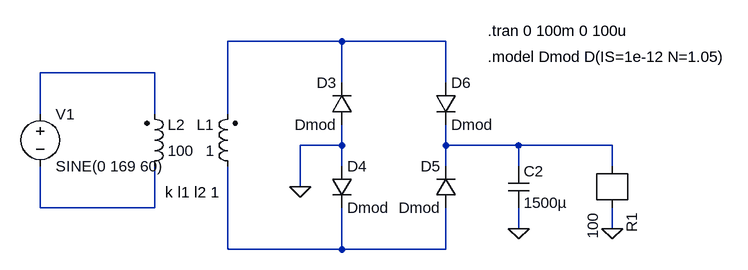
[diagram p0: schematic circuit_a_lt.asc]
circuit_a_lt.asc, the LTspice schematic file:
Version 4
SHEET 1 2116 1016
WIRE 496 -256 320 -256
WIRE 656 -256 496 -256
WIRE 208 -208 32 -208
WIRE 496 -192 496 -256
WIRE 656 -192 656 -256
WIRE 32 -144 32 -208
WIRE 208 -144 208 -208
WIRE 320 -144 320 -256
WIRE 496 -96 496 -128
WIRE 496 -96 432 -96
WIRE 656 -96 656 -128
WIRE 768 -96 656 -96
WIRE 912 -96 768 -96
WIRE 496 -64 496 -96
WIRE 656 -64 656 -96
WIRE 768 -64 768 -96
WIRE 912 -64 912 -96
WIRE 432 -32 432 -96
WIRE 32 0 32 -64
WIRE 208 0 208 -64
WIRE 208 0 32 0
WIRE 768 32 768 0
WIRE 912 32 912 0
WIRE 320 64 320 -64
WIRE 496 64 496 0
WIRE 496 64 320 64
WIRE 656 64 656 0
WIRE 656 64 496 64
FLAG 768 32 0
FLAG 912 32 0
FLAG 432 -32 0
SYMBOL voltage 32 -160 R0
SYMATTR InstName V1
SYMATTR Value SINE(0 169 60)
SYMATTR SpiceLine Rser=1
SYMBOL cap 752 -64 R0
SYMATTR InstName C2
SYMATTR Value 1500µ
SYMBOL ind2 336 -48 R180
WINDOW 0 36 80 Left 2
WINDOW 3 36 40 Left 2
SYMATTR InstName L1
SYMATTR Value 1
SYMATTR Type ind
SYMBOL ind2 192 -48 M180
WINDOW 0 36 80 Left 2
WINDOW 3 36 40 Left 2
SYMATTR InstName L2
SYMATTR Value 100
SYMATTR Type ind
SYMBOL r 912 -64 R90
SYMATTR InstName R1
SYMATTR Value 100
SYMBOL diode 512 -128 R180
WINDOW 0 24 64 Left 2
WINDOW 3 24 0 Left 2
SYMATTR InstName D3
SYMATTR Value Dmod
SYMBOL diode 480 -64 R0
SYMATTR InstName D4
SYMATTR Value Dmod
SYMBOL diode 672 0 R180
WINDOW 0 24 64 Left 2
WINDOW 3 24 0 Left 2
SYMATTR InstName D5
SYMATTR Value Dmod
SYMBOL diode 640 -192 R0
SYMATTR InstName D6
SYMATTR Value Dmod
TEXT 720 -272 Left 2 !.tran 0 100m 0 100u
TEXT 720 -232 Left 2 !.model Dmod D(IS=1e-12 N=1.05)
TEXT 224 -24 Left 2 !k l1 l2 1

The netlist it stands for:
* circuit_a_lt.asc
V1 N002 N004 SINE(0 169 60) Rser=1
C2 N003 0 1500µ
L1 N005 N001 1
L2 N004 N002 100
R1 0 N003 100
D3 0 N001 Dmod
D4 0 N005 Dmod
D5 N005 N003 Dmod
D6 N001 N003 Dmod
.model D D
.lib standard.dio
.tran 0 100m 0 100u
.model Dmod D(IS=1e-12 N=1.05)
k l1 l2 1
.backanno
.end